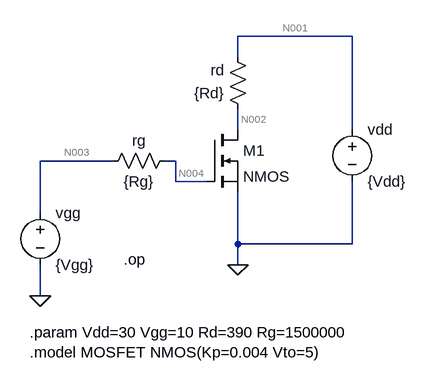
[diagram p0: schematic Q7-3.asc]
Q7-3.asc, the LTspice schematic file:
Version 4
SHEET 1 880 680
WIRE 512 -112 336 -112
WIRE 336 -80 336 -112
WIRE 336 32 336 0
WIRE 512 32 512 -112
WIRE 144 80 32 80
WIRE 240 80 224 80
WIRE 240 112 240 80
WIRE 288 112 240 112
WIRE 32 160 32 80
WIRE 336 208 336 128
WIRE 512 208 512 112
WIRE 512 208 336 208
WIRE 336 240 336 208
WIRE 32 288 32 240
FLAG 32 288 0
FLAG 336 240 0
SYMBOL res 240 64 R90
WINDOW 0 0 56 VBottom 2
WINDOW 3 32 56 VTop 2
SYMATTR InstName rg
SYMATTR Value {Rg}
SYMBOL res 352 16 R180
WINDOW 0 36 76 Left 2
WINDOW 3 36 40 Left 2
SYMATTR InstName rd
SYMATTR Value {Rd}
SYMBOL voltage 512 16 R0
SYMATTR InstName vdd
SYMATTR Value {Vdd}
SYMBOL voltage 32 144 R0
SYMATTR InstName vgg
SYMATTR Value {Vgg}
SYMBOL nmos 288 32 R0
SYMATTR InstName M1
TEXT 16 344 Left 2 !.param Vdd=30 Vgg=10 Rd=390 Rg=1500000\n.model MOSFET NMOS(Kp=0.004 Vto=5)
TEXT 160 232 Left 2 !.op

The netlist it stands for:
* Q7-3.asc
rg N004 N003 {Rg}
rd N002 N001 {Rd}
vdd N001 0 {Vdd}
vgg N003 0 {Vgg}
M1 N002 N004 0 0 NMOS
.model NMOS NMOS
.model PMOS PMOS
.lib standard.mos
.param Vdd=30 Vgg=10 Rd=390 Rg=1500000
.model MOSFET NMOS(Kp=0.004 Vto=5)
.op
.backanno
.end

* Results of the author's LTspice run, read from the files saved beside the schematic
* Operating Point:
*   V(n004) = 10 V
*   V(n003) = 10 V
*   V(n002) = 29.61 V
*   V(n001) = 30 V
*   Id(M1) = 1 mA
*   Ig(M1) = 0 A
*   Ib(M1) = -29.62 pA
*   Is(M1) = -1 mA
*   I(Rd) = -1 mA
*   I(Rg) = 0 A
*   I(Vgg) = 0 A
*   I(Vdd) = -1 mA
* From the log:
*   Semiconductor Device Operating Points:
*                           --- MOSFET Transistors ---
*   Name:          m1
*   Model:        nmos
*   Id:          1.00e-03
*   Vgs:         1.00e+01
*   Vds:         2.96e+01
*   Vbs:         0.00e+00
*   Vth:         0.00e+00
*   Vdsat:       1.00e+01
*   Gm:          2.00e-04
*   Gds:         0.00e+00
*   Gmb:         0.00e+00
*   Cbd:         0.00e+00
*   Cbs:         0.00e+00
*   Cgsov:       0.00e+00
*   Cgdov:       0.00e+00
*   Cgbov:       0.00e+00
*   Cgs:         0.00e+00
*   Cgd:         0.00e+00
*   Cgb:         0.00e+00